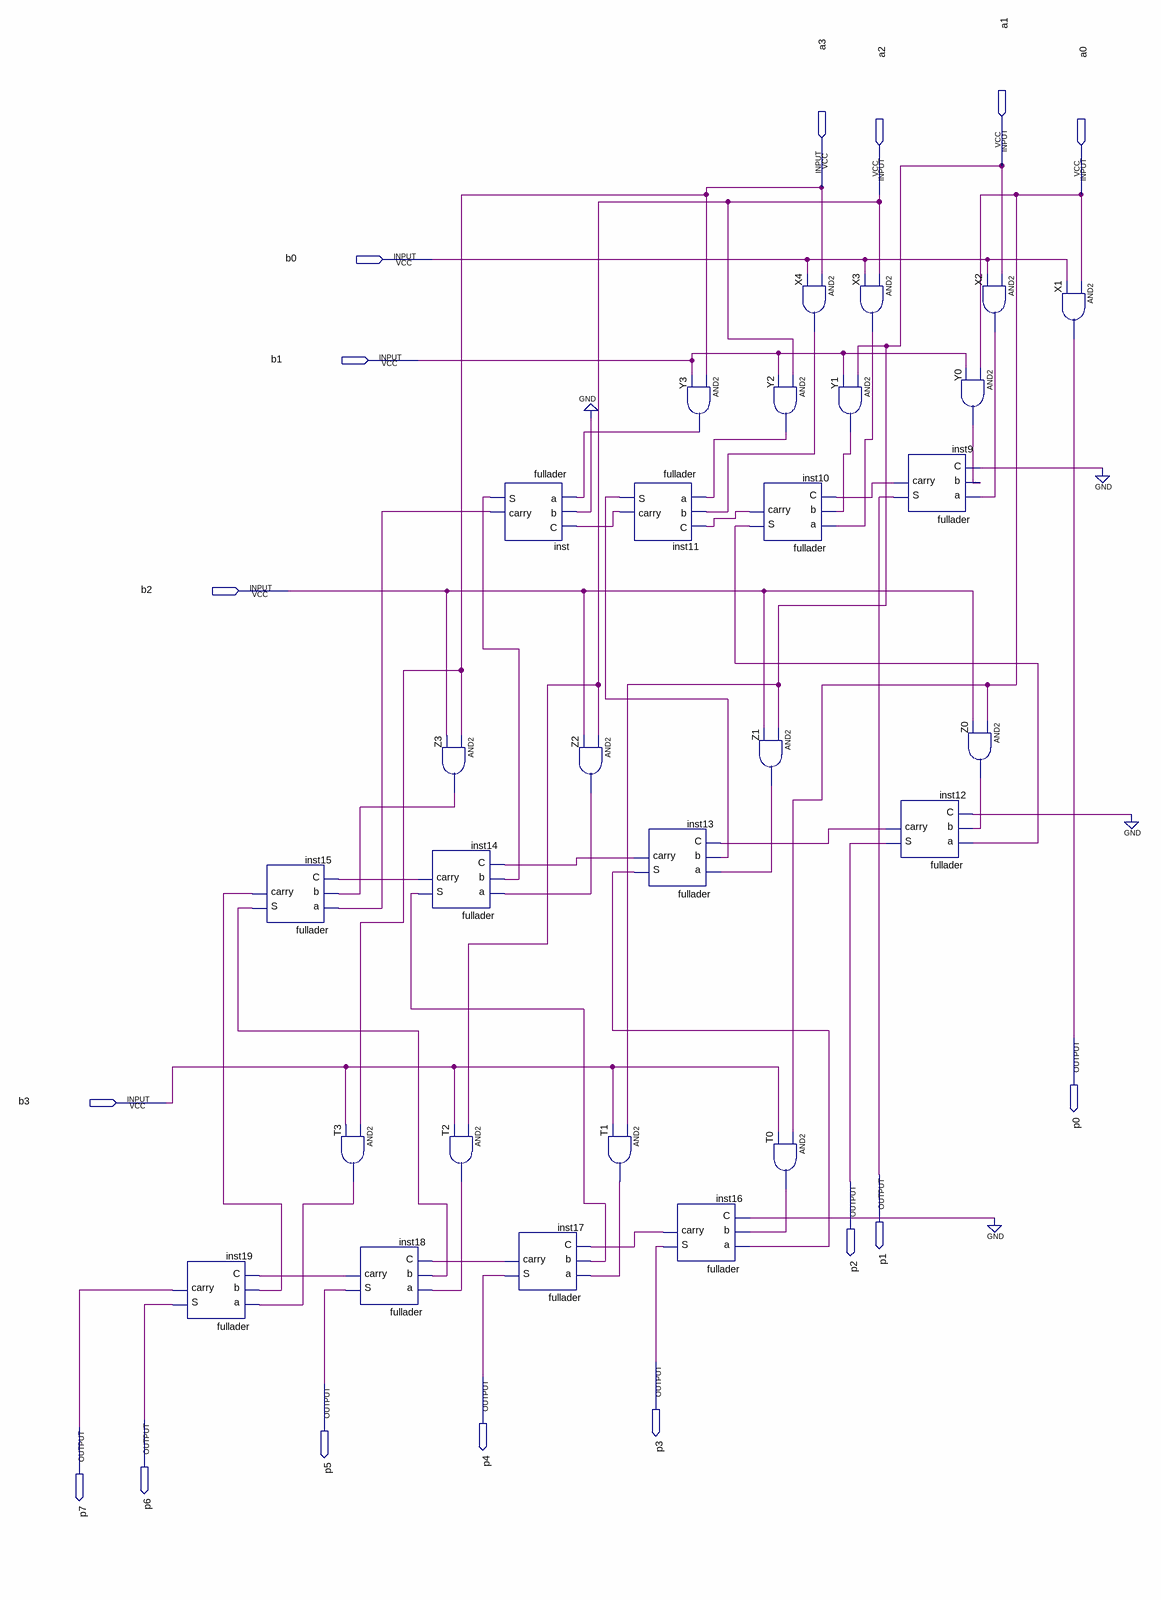
[diagram p0: schematic sheet]
// Quartus schematic Multiplier4bit.bdf as structural Verilog: 28 symbols, 16 pins
module Multiplier4bit (
  input  a1,
  input  a3,
  input  a2,
  input  a0,
  input  b0,
  input  b1,
  input  b2,
  input  b3,
  output p0,
  output p1,
  output p2,
  output p3,
  output p4,
  output p5,
  output p6,
  output p7
);

  wire inst9_carry, inst10_carry, inst10_s, inst11_carry, inst11_s, inst12_carry, inst13_carry, inst13_s,
       inst14_carry, inst14_s, inst15_carry, inst15_s, inst16_carry, inst17_carry, inst18_carry, inst_carry,
       inst_s, T0_out, T1_out, T2_out, T3_out, X2_out, X3_out, X4_out, Y0_out, Y1_out, Y2_out, Y3_out,
       Z0_out, Z1_out, Z2_out, Z3_out;

  fullader inst19 (.a(T3_out), .b(inst15_carry), .C(inst18_carry), .S(p6), .carry(p7));
  fullader inst15 (.a(inst_carry), .b(Z3_out), .C(inst14_carry), .S(inst15_s), .carry(inst15_carry));
  and T3 (T3_out, a3, b3);
  fullader inst18 (.a(T2_out), .b(inst15_s), .C(inst17_carry), .S(p5), .carry(inst18_carry));
  and Z3 (Z3_out, a3, b2);
  fullader inst14 (.a(Z2_out), .b(inst_s), .C(inst13_carry), .S(inst14_s), .carry(inst14_carry));
  and T2 (T2_out, a2, b3);
  fullader inst (.a(Y3_out), .b(1'b0), .C(inst11_carry), .S(inst_s), .carry(inst_carry));
  fullader inst17 (.a(T1_out), .b(inst14_s), .C(inst16_carry), .S(p4), .carry(inst17_carry));
  fullader inst11 (.a(Y2_out), .b(X4_out), .C(inst10_carry), .S(inst11_s), .carry(inst11_carry));
  and Z2 (Z2_out, a2, b2);
  and T1 (T1_out, a1, b3);
  and Y3 (Y3_out, a3, b1);
  fullader inst13 (.a(Z1_out), .b(inst11_s), .C(inst12_carry), .S(inst13_s), .carry(inst13_carry));
  fullader inst16 (.a(inst13_s), .b(T0_out), .C(1'b0), .S(p3), .carry(inst16_carry));
  and X4 (X4_out, a3, b0);
  and Y2 (Y2_out, a2, b1);
  fullader inst10 (.a(X3_out), .b(Y1_out), .C(inst9_carry), .S(inst10_s), .carry(inst10_carry));
  and Z1 (Z1_out, a1, b2);
  and T0 (T0_out, a0, b3);
  and X3 (X3_out, a2, b0);
  and Y1 (Y1_out, a1, b1);
  fullader inst9 (.a(X2_out), .b(Y0_out), .C(1'b0), .S(p1), .carry(inst9_carry));
  fullader inst12 (.a(inst10_s), .b(Z0_out), .C(1'b0), .S(p2), .carry(inst12_carry));
  and Y0 (Y0_out, a0, b1);
  and Z0 (Z0_out, a0, b2);
  and X2 (X2_out, a1, b0);
  and X1 (p0, a0, b0);
endmodule
